# Altium schematic sheet 03_Power_Supply.SchDoc
size A4
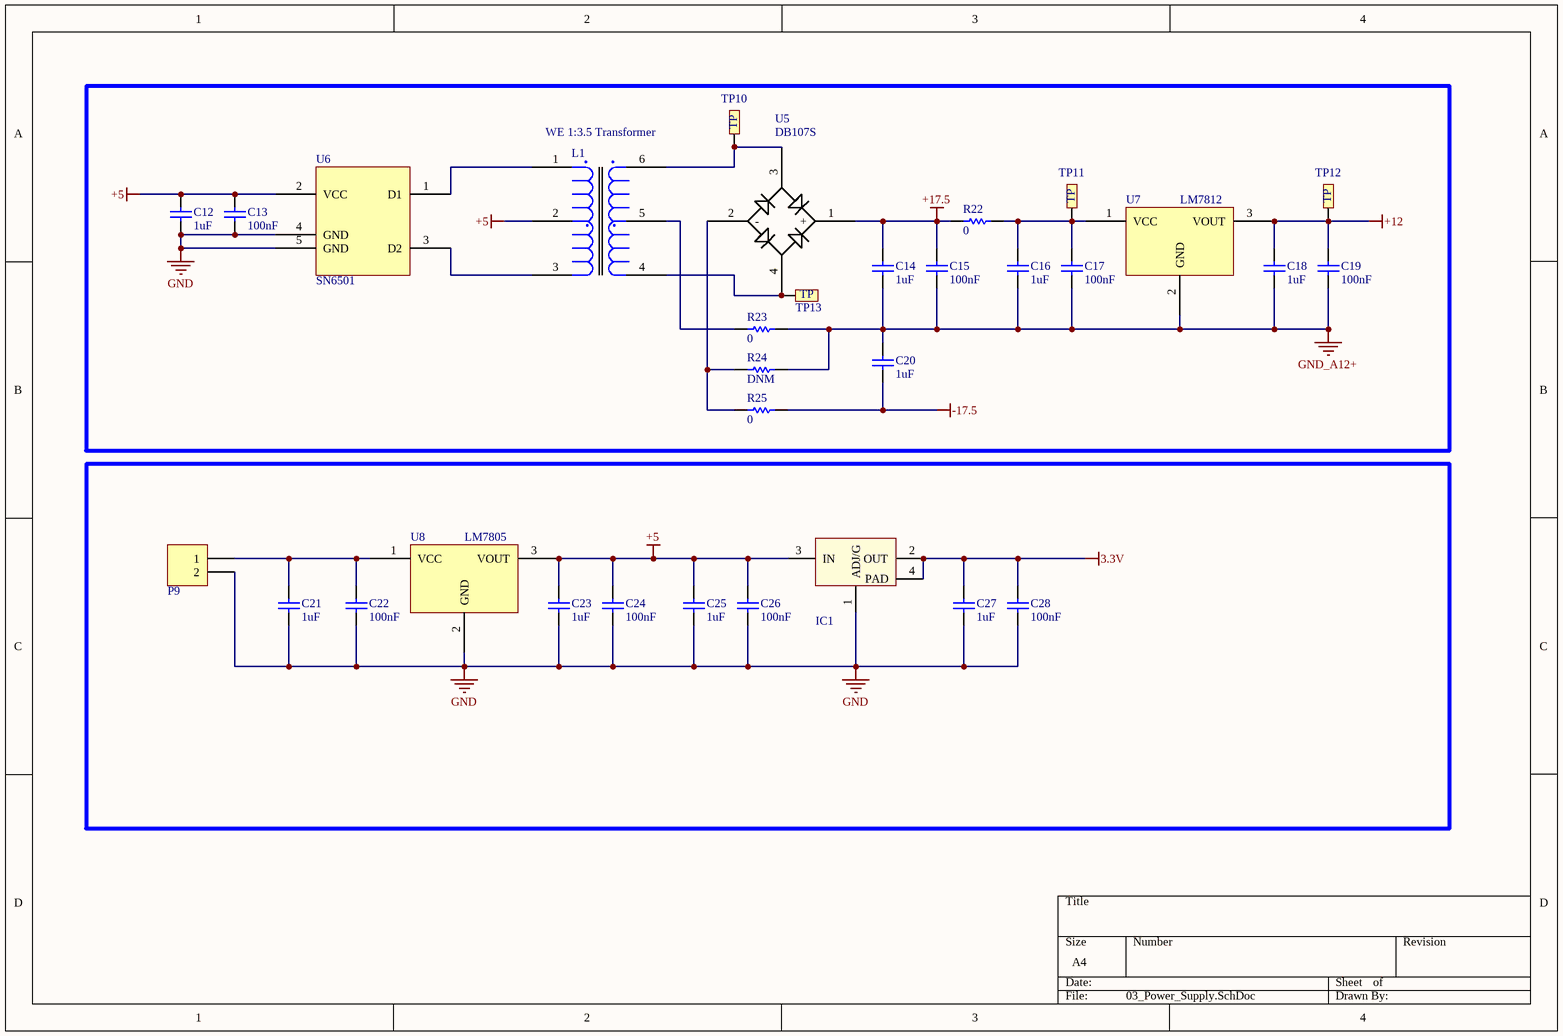
[diagram p0: 03_Power_Supply.SchDoc]

## Parts
C12  value 1uF  [CAP-SM-0805]  (hidden comment: Cap Non-Pol SMD)
C13  value 100nF  [CAP-SM-0805]  (hidden comment: Cap Non-Pol SMD)
C14  value 1uF  [CAP-SM-0805]  (hidden comment: Cap Non-Pol SMD)
C15  value 100nF  [CAP-SM-0805]  (hidden comment: Cap Non-Pol SMD)
C16  value 1uF  [CAP-SM-0805]  (hidden comment: Cap Non-Pol SMD)
C17  value 100nF  [CAP-SM-0805]  (hidden comment: Cap Non-Pol SMD)
C18  value 1uF  [CAP-SM-0805]  (hidden comment: Cap Non-Pol SMD)
C19  value 100nF  [CAP-SM-0805]  (hidden comment: Cap Non-Pol SMD)
C20  value 1uF  [CAP-SM-0805]  (hidden comment: Cap Non-Pol SMD)
C21  value 1uF  [CAP-SM-0805]  (hidden comment: Cap Non-Pol SMD)
C22  value 100nF  [CAP-SM-0805]  (hidden comment: Cap Non-Pol SMD)
C23  value 1uF  [CAP-SM-0805]  (hidden comment: Cap Non-Pol SMD)
C24  value 100nF  [CAP-SM-0805]  (hidden comment: Cap Non-Pol SMD)
C25  value 1uF  [CAP-SM-0805]  (hidden comment: Cap Non-Pol SMD)
C26  value 100nF  [CAP-SM-0805]  (hidden comment: Cap Non-Pol SMD)
C27  value 1uF  [CAP-SM-0805]  (hidden comment: Cap Non-Pol SMD)
C28  value 100nF  [CAP-SM-0805]  (hidden comment: Cap Non-Pol SMD)
IC1  LM1117  [SOT223-4N]  (value not drawn)
L1  WE 1:3.5 Transformer  [750316818]
P9  Domino 2  [DOMINO 2- 5mm]  (value not drawn)
R22  value 0  [RES-SM-1206]  (hidden comment: RESISTOR SMD)
R23  value 0  [RES-SM-1206]  (hidden comment: RESISTOR SMD)
R24  value DNM  [RES-SM-1206]  (hidden comment: RESISTOR SMD)
R25  value 0  [RES-SM-1206]  (hidden comment: RESISTOR SMD)
TP10  Test Point  [TP]  (value not drawn)
TP11  Test Point  [TP]  (value not drawn)
TP12  Test Point  [TP]  (value not drawn)
TP13  Test Point  [TP]  (value not drawn)
U5  DB107S  [SOT510P990X365-4N]
U6  SN6501  [SOT95P280X145-5N]
U7  LM7812  [DPAK228P1014X239-3N]
U8  LM7805  [DPAK228P1014X239-3N]

## Nets
3.3V: C27.2 C28.2 IC1.2(OUT) IC1.4(PAD)
+5: C12.2 C13.2 C23.2 C24.2 C25.2 C26.2 IC1.3(IN) L1.2 U6.2(VCC) U8.3(VOUT)
+12: C18.2 C19.2 TP12.TP1 U7.3(VOUT)
+17.5: C14.2 C15.2 R22.1 U5.1(+)
-17.5: C20.1 R25.1
GND: C12.1 C13.1 C21.1 C22.1 C23.1 C24.1 C25.1 C26.1 C27.1 C28.1 IC1.1(ADJ/G) P9.2 U6.4(GND) U6.5(GND) U8.2(GND)
GND_A12+: C14.1 C15.1 C16.1 C17.1 C18.1 C19.1 C20.2 R23.2 R24.2 U7.2(GND)
NetC16_2: C16.2 C17.2 R22.2 TP11.TP1 U7.1(VCC)
NetC21_2: C21.2 C22.2 P9.1 U8.1(VCC)
NetL1_1: L1.1 U6.1(D1)
NetL1_3: L1.3 U6.3(D2)
NetL1_4: L1.4 TP13.TP1 U5.4
NetL1_5: L1.5 R23.1
NetL1_6: L1.6 TP10.TP1 U5.3
NetR24_1: R24.1 R25.2 U5.2(-)

## Notes on the sheet
- (in symbol Test Point) TP

## Library data of the parts
C12-C28 = Cap Non-Pol SMD: Capacitor
IC1 = LM1117: Available in 1.8V, 2.5V, 2.85V, 3.3V, 5V, and  Adjustable Versions; Value: LM317
L1 = WE 1:3.5 Transformer: Manufacturer: Wurth Elektronik; ComponentLink1Description: Supplier 1 Link; ComponentLink1URL: https://www.mouser.vn/ProductDetail/Wurth-Elektronik/750316818?qs=%2Fha2pyFaduhwWLO%2FwuaxPfkbn2Vm0sf%2F6JG8uX8izSO8%2FxDOwuQ00g%3D%3D; Manufacturer P/N: 750316818; Supplier 1: Mouser; Supplier 1 P/N: 710-750316818
P9 = Domino 2: Domino, 2-Pin; LatestRevisionDate: 17-Jul-2002; LatestRevisionNote: Re-released for DXP Platform.; Publisher: Altium Limited
R22-R25 = RESISTOR SMD: Resistor
U7 U8 = LM78xx